# EAGLE design Yaris speed door lock-ext power and relays (EAGLE 9.2.2)
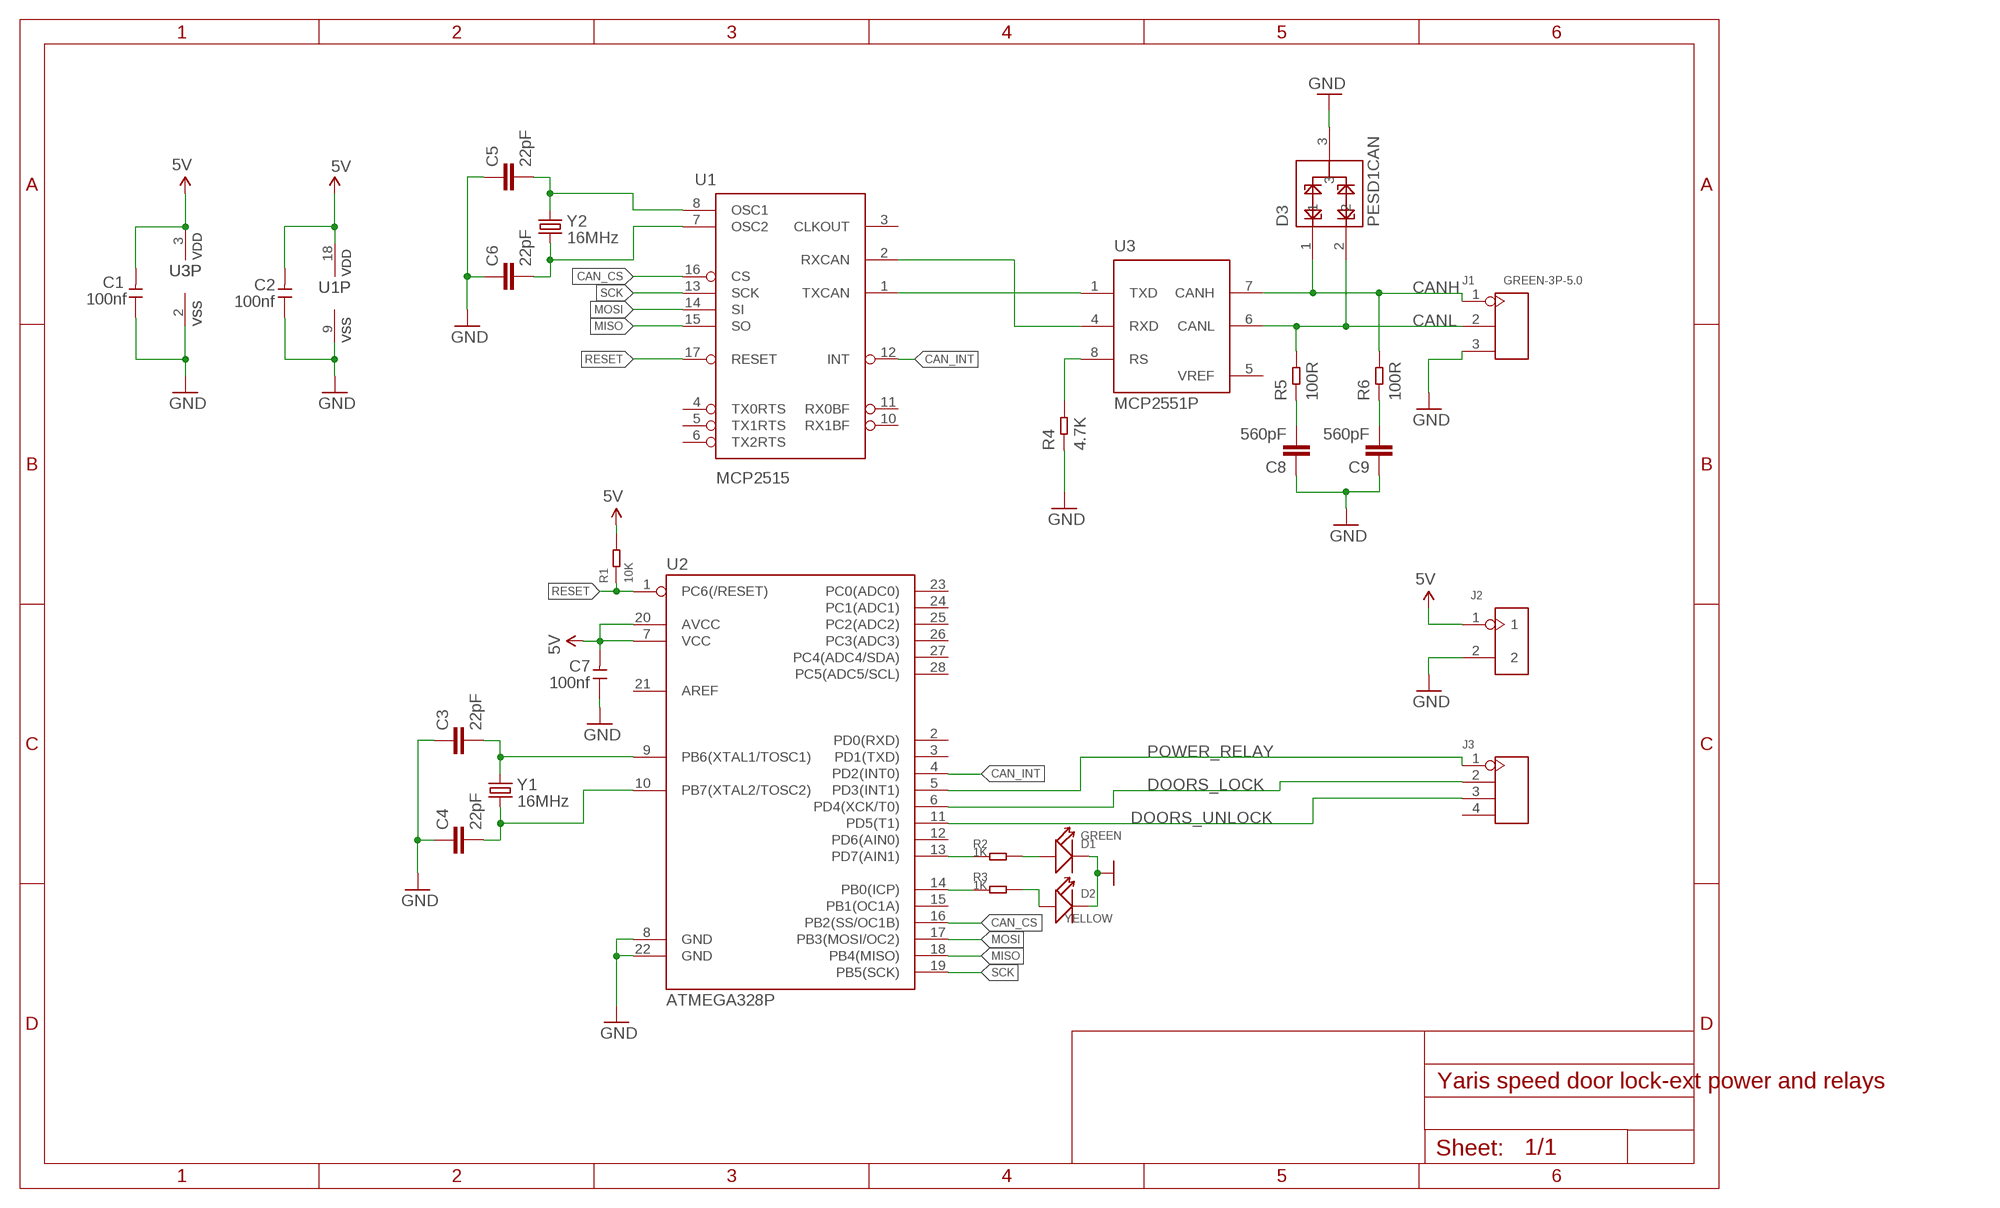
[diagram p0: schematic, sheet 1]

## Parts
C1  100nf  DIP-CERAMIC-DISC-100NF-50V-Y5V(D5.0MM)  [CERAMIC-2.54]
C2  100nf  DIP-CERAMIC-DISC-100NF-50V-Y5V(D5.0MM)  [CERAMIC-2.54]
C3  22pF  22PF-PTH-2.54MM-200V-5%  [CAP-PTH-2.54]
C4  22pF  22PF-PTH-2.54MM-200V-5%  [CAP-PTH-2.54]
C5  22pF  22PF-PTH-2.54MM-200V-5%  [CAP-PTH-2.54]
C6  22pF  22PF-PTH-2.54MM-200V-5%  [CAP-PTH-2.54]
C7  100nf  DIP-CERAMIC-DISC-100NF-50V-Y5V(D5.0MM)  [CERAMIC-2.54]
C8  560pF  560PF-50V-5%(0603)  [0603-CAP]
C9  560pF  560PF-50V-5%(0603)  [0603-CAP]
D1  GREEN  DIP-LED-GREEN-GREEN(2P-D3MM)  [LED2-2.54-D3.0MM]
D2  YELLOW  DIP-LED-GREEN-GREEN(2P-D3MM)  [LED2-2.54-D3.0MM]
D3  PESD1CAN  [SOT23-3]
J1  GREEN-3P-5.0  SCREW-TERMINAL-GREEN(3P-5.0)  [H3-5.0-15.5X8.0MM]
J2  DIP-BLACK-JUMPER  [H2-2.54]
J3  DIP-BLACK-FEMALE-HEADER-VERT(4P-2.54)  [H4-2.54]
R1  10K  DIP-RES-10K-5%-1/4W(PR-D2.3XL6.5MM)  [PR-D2.3XL6.5MM]
R2  1K  DIP-RES-1K-5%-1/4W(PR-D2.3XL6.5MM)  [PR-D2.3XL6.5MM]
R3  1K  DIP-RES-1K-5%-1/4W(PR-D2.3XL6.5MM)  [PR-D2.3XL6.5MM]
R4  4.7K  DIP-RES-4.7K-5%-1/4W(PR-D2.3XL6.5MM)  [PR-D2.3XL6.5MM]
R5  100R  DIP-RES-100R-5%-1/4W(PR-D2.3XL6.5MM)  [PR-D2.3XL6.5MM]
R6  100R  DIP-RES-100R-5%-1/4W(PR-D2.3XL6.5MM)  [PR-D2.3XL6.5MM]
U1  MCP2515  MCP2510SO  [SO-18W]
U2  ATMEGA328P  ATMEGA328P_PDIP  [DIP28]
U3  MCP2551P  [DIL8]
Y1  16MHz  CRYSTALHC49US  [HC49US]
Y2  16MHz  CRYSTALHC49US  [HC49US]

## Nets
5V: C1.2 C2.2 C7.2 J2.1 R1.2 U1.18(VDD) U2.7(VCC) U2.20(AVCC) U3.3(VDD)
CAN_CS: U1.16(CS) U2.16(PB2(SS/OC1B))
CAN_INT: U1.12(INT) U2.4(PD2(INT0))
CAN_RXD: U1.2(RXCAN) U3.4(RXD)
CAN_TXD: U1.1(TXCAN) U3.1(TXD)
CANH: D3.1 J1.1 R6.2 U3.7(CANH)
CANL: D3.2 J1.2 R5.2 U3.6(CANL)
DOORS_LOCK: J3.2 U2.6(PD4(XCK/T0))
DOORS_UNLOCK: J3.3 U2.11(PD5(T1))
GND: C1.1 C2.1 C3.1 C4.1 C5.1 C6.1 C7.1 C8.1 C9.1 D1.K(-) D2.K(-) D3.3 J1.3 J2.2 R4.1 U1.9(VSS) U2.8(GND) U2.22(GND) U3.2(VSS)
MISO: U1.15(SO) U2.18(PB4(MISO))
MOSI: U1.14(SI) U2.17(PB3(MOSI/OC2))
N$1: C3.2 U2.9(PB6(XTAL1/TOSC1)) Y1.2
N$2: C4.2 U2.10(PB7(XTAL2/TOSC2)) Y1.1
N$9: C8.2 R5.1
N$10: C9.2 R6.1
N$13: R2.1 U2.13(PD7(AIN1))
N$14: R4.2 U3.8(RS)
N$15: R3.1 U2.14(PB0(ICP))
N$16: D1.A(+) R2.2
N$17: C5.2 U1.8(OSC1) Y2.2
N$18: C6.2 U1.7(OSC2) Y2.1
N$19: D2.A(+) R3.2
POWER_RELAY: J3.1 U2.5(PD3(INT1))
RESET: R1.1 U1.17(RESET) U2.1(PC6(/RESET))
SCK: U1.13(SCK) U2.19(PB5(SCK))
Unconnected: J3.4 U1.3(CLKOUT) U1.4(TX0RTS) U1.5(TX1RTS) U1.6(TX2RTS) U1.10(RX1BF) U1.11(RX0BF) U2.2(PD0(RXD)) U2.3(PD1(TXD)) U2.12(PD6(AIN0)) U2.15(PB1(OC1A)) U2.21(AREF) U2.23(PC0(ADC0)) U2.24(PC1(ADC1)) U2.25(PC2(ADC2)) U2.26(PC3(ADC3)) U2.27(PC4(ADC4/SDA)) U2.28(PC5(ADC5/SCL))

## Power pins joined to a net without a drawn wire
VREF: U3.5(VREF)

## Library data of the parts
C1 C2 C7 = OPL_Capacitor:DIP-CERAMIC-DISC-100NF-50V-Y5V(D5.0MM): 302010208; MPN: CC1-F5SL2A101KSPW
C3-C6 = SparkFun-Capacitors:22PF: 22pF ceramic capacitors A capacitor is a passive two-terminal electrical component used to store electrical energy temporarily in an electric field.; PROD_ID: CAP-09128
C8 C9 = SparkFun-Capacitors:560PF-50V-5%(0603): CAP-08749; PROD_ID: CAP-08749
D1 D2 = OPL_Optoelectronics:DIP-LED-GREEN-GREEN(2P-D3MM): 304090040; MPN: CX-G302DC; VALUE: CX-G302DC
D3 = SparkFun-DiscreteSemi:PESD1CAN: PESD1CAN is used to protect two automotive CAN bus lines from ESD.; PROD_ID: DIO-12501
J1 = OPL_Connector:SCREW-TERMINAL-GREEN(3P-5.0): 320110029
J2 = OPL_Connector:DIP-BLACK-JUMPER: 320190003
J3 = OPL_Connector:DIP-BLACK-FEMALE-HEADER-VERT(4P-2.54): 320030017; MPN: F185-1104A1BSYA1; VALUE: 4p-2.54
R1 = OPL_Resistor:DIP-RES-10K-5%-1/4W(PR-D2.3XL6.5MM): 301020001; MPN: FHCFR-1/4W-103J
R2 R3 = OPL_Resistor:DIP-RES-1K-5%-1/4W(PR-D2.3XL6.5MM): 301020000; MPN: FHCFR-1/4W-102J
R4 = OPL_Resistor:DIP-RES-4.7K-5%-1/4W(PR-D2.3XL6.5MM): 301020012; MPN: FHCFR-1/4W-472J
R5 R6 = OPL_Resistor:DIP-RES-100R-5%-1/4W(PR-D2.3XL6.5MM): 301020017; MPN: FHCFR-1/4W-101J
U1 = SparkFun-DigitalIC:MCP2510: CAN controller with SPI interface to any MCU. Original design by Microchip.; PROD_ID: IC-09906
U2 = SparkFun-IC-Microcontroller:ATMEGA328P_PDIP: Atmel 328P Through hole ATMEGA328P uC used in the Arduino 32kb flash, 1k EEPROM, 2k SRAM Datasheet <http://www.sparkfun.com/datasheets/Components/SMD/ATMega328.pdf> SparkFun Products Storefront component: AVR 28 Pin 20MHz 32K 6A/D - ATMega328P <https://www.sparkfun.com/products/9061> (COM-09061) SparkFun Simon Says - Through-Hole Soldering Kit <https://www.sparkfun.com/products/10547> (KIT-10547) SparkFun Learn to Solder - Simon Says <https://www.sparkfun.com/products/13708> (KIT-13708) SparkFun BigTime Watch Kit <https://www.sparkfun.com/products/11734> (KIT-11734) SparkFun ClockIt <https://www.sparkfun.com/products/10930> (KIT-10930) SparkFun Serial Enabled LCD Kit <https://www.sparkfun.com/products/10097> (LCD-10097) SparkFun Simon Tilts - Through Hole Soldering Kit <https://www.sparkfun.com/products/12634> (KIT-12634) SparkFun Frequency Counter Kit <https://www.sparkfun.com/products/10140> (KIT-10140) FabFM Radio Kit <https://www.sparkfun.com/products/11043> (KIT-11043) SparkFun Binary Blaster Kit <https://www.sparkfun.com/products/12037> (KIT-12037) SparkFun Metro-Gnome <https://www.sparkfun.com/products/9236> (KIT-09236) ATmega328 with Arduino Optiboot (Uno) <https://www.sparkfun.com/products/10524> (DEV-10524); PROD_ID: IC-09136; VALUE: 328P
U3 = microchip_can:MCP2551: High Speed CAN tranceiver
Y1 Y2 = SparkFun-FreqCtrl:CRYSTAL: Various standard crystals. Proven footprints.

## Net classes
0 default: width 0.5 mm, drill 0.8 mm, clearance 0.5 mm

## Board
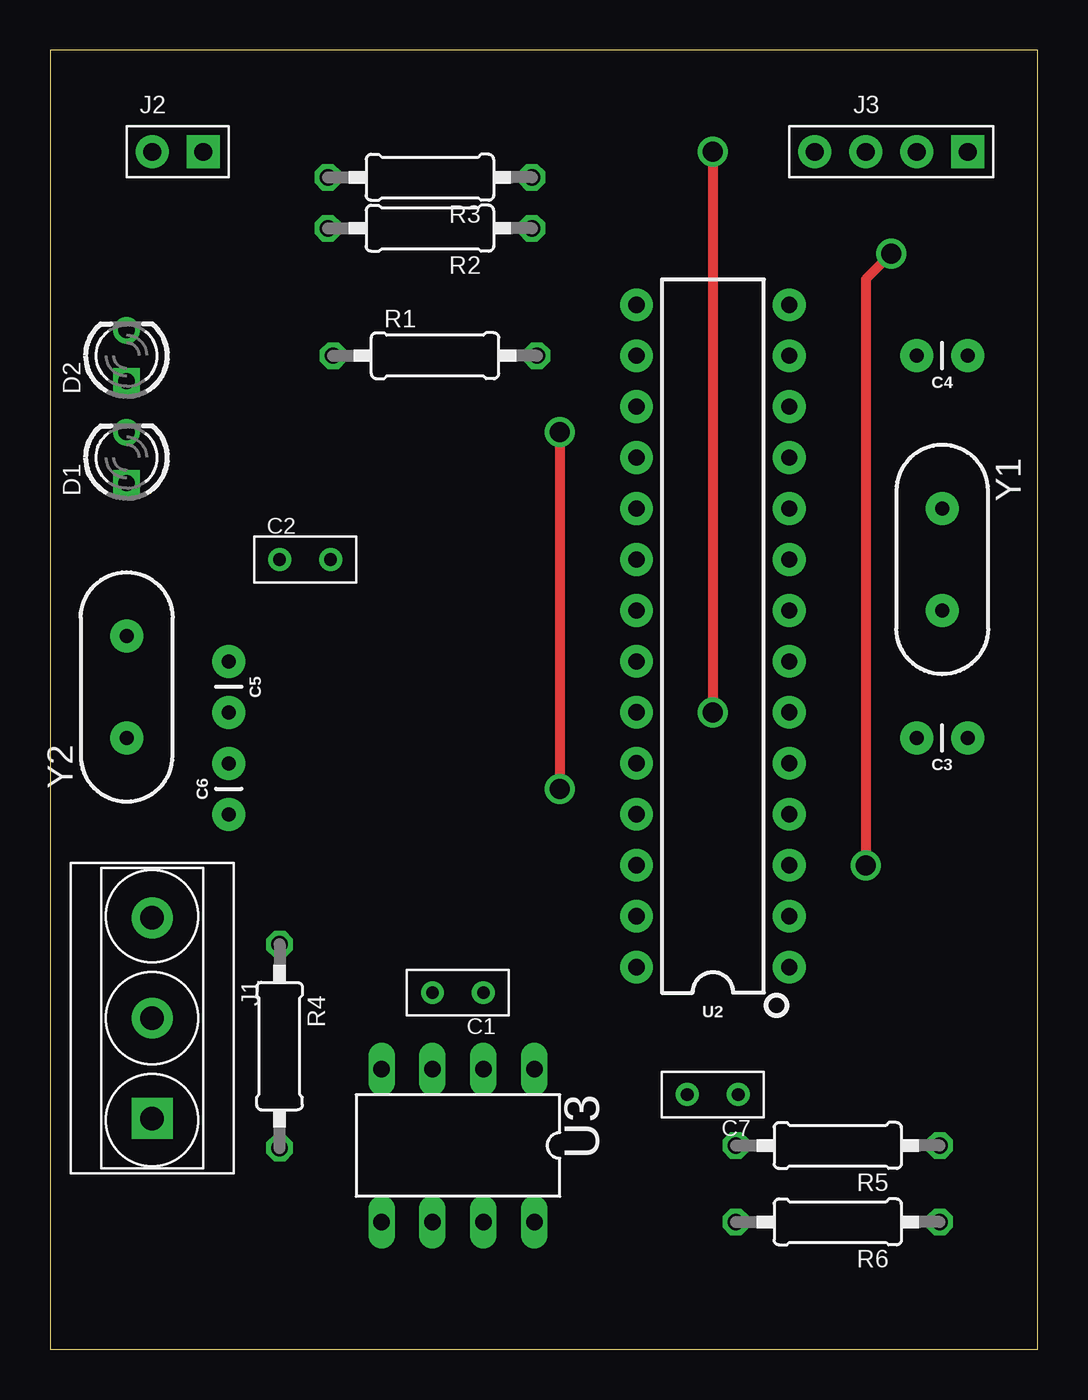
[diagram p1: board, top side]
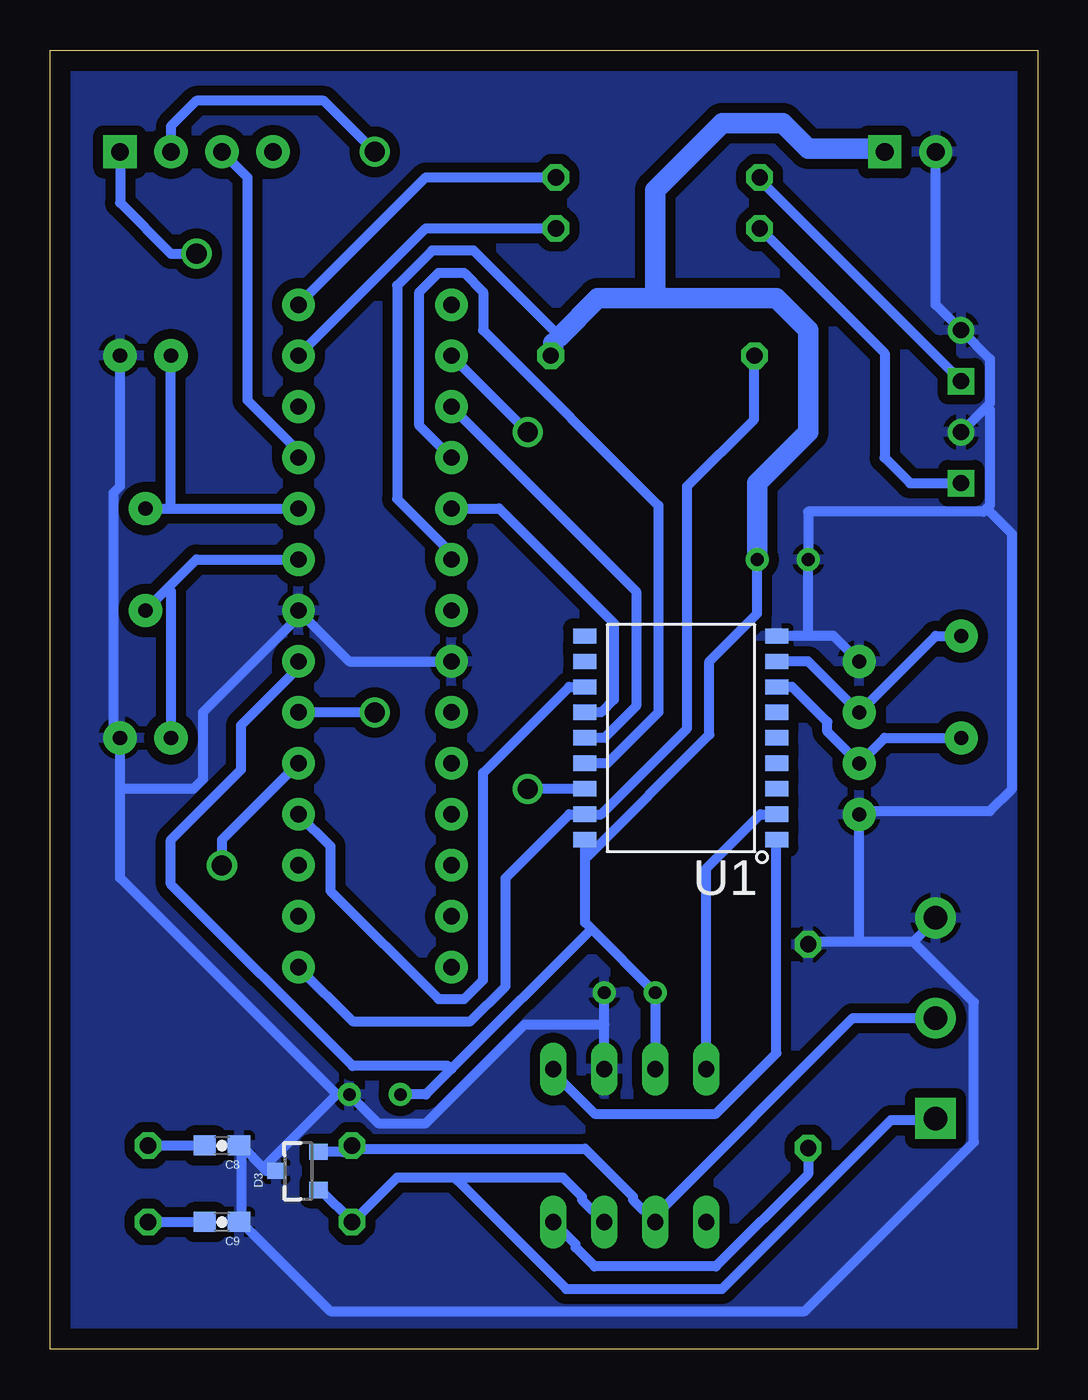
[diagram p2: board, bottom side, seen from below]

Size 49.2 x 64.76 mm. Coordinates in mm from the lower left corner, seen from the top.
Outline: 0,0 49.2,0 49.2,64.76 0,64.76 0,0
Copper layers (1*16): Top 0.035mm / dielectric 1.5mm / Bottom 0.035mm
Design rules "Yaris speed door lock-ext power and relays": minimum track width 6mil, minimum drill 0.35mm, track to track 0.205mm, track to pad 0.205mm, pad to pad 0.205mm, via to via 0.205mm, smd to smd 6mil, copper to edge 40mil, drill to drill 6mil, minimum pad ring 10mil, minimum via ring 8mil, stop-mask expansion 4mil, vias tented up to drill 0mil, thermal gap 10mil

### Footprints (pad centres in the part's own frame; a part is rotated, then mirrored left to right if it is on the bottom)
CERAMIC-2.54 = drill 0.635 pad 1.143: 1 -1.27,0; 2 1.27,0
CAP-PTH-2.54 = drill 0.7 pad 1.651: 1 -1.27,0; 2 1.27,0
0603-CAP = smd 1.1 x 1: 1 -0.85,0; 2 0.85,0
LED2-2.54-D3.0MM = drill 0.813 square: A -1.27,0 | drill 0.813: K 1.27,0
SOT23-3 = smd 0.8 x 0.9: 1 -0.95,-1; 2 0.95,-1; 3 0,1.1
H3-5.0-15.5X8.0MM = drill 1.168 pad 2.032 square: 1 0,5 | drill 1.168 pad 2.032: 2 0,0; 3 0,-5
H2-2.54 = drill 0.889 pad 1.651 square: 1 0,1.27 | drill 0.889 pad 1.651: 2 0,-1.27
H4-2.54 = drill 0.889 pad 1.651 square: 1 0,3.81 | drill 0.889 pad 1.651: 2 0,1.27; 3 0,-1.27; 4 0,-3.81
PR-D2.3XL6.5MM = drill 0.813 octagon: 1 -4.953,0; 2 5.207,0
SO-18W = smd 0.762 x 1.143: 1 -5.08,-4.788; 2 -3.81,-4.788; 3 -2.54,-4.788; 4 -1.27,-4.788; 5 0,-4.788; 6 1.27,-4.788; 7 2.54,-4.788; 8 3.81,-4.788; 9 5.08,-4.788; 10 5.08,4.788; 11 3.81,4.788; 12 2.54,4.788; 13 1.27,4.788; 14 0,4.788; 15 -1.27,4.788; 16 -2.54,4.788; 17 -3.81,4.788; 18 -5.08,4.788
DIP28 = drill 0.813 pad 1.626: 1 -16.51,-3.81; 2 -13.97,-3.81; 3 -11.43,-3.81; 4 -8.89,-3.81; 5 -6.35,-3.81; 6 -3.81,-3.81; 7 -1.27,-3.81; 8 1.27,-3.81; 9 3.81,-3.81; 10 6.35,-3.81; 11 8.89,-3.81; 12 11.43,-3.81; 13 13.97,-3.81; 14 16.51,-3.81; 15 16.51,3.81; 16 13.97,3.81; 17 11.43,3.81; 18 8.89,3.81; 19 6.35,3.81; 20 3.81,3.81; 21 1.27,3.81; 22 -1.27,3.81; 23 -3.81,3.81; 24 -6.35,3.81; 25 -8.89,3.81; 26 -11.43,3.81; 27 -13.97,3.81; 28 -16.51,3.81
DIL8 = drill 0.813 long: 1 -3.81,-3.81; 2 -1.27,-3.81; 3 1.27,-3.81; 4 3.81,-3.81; 5 3.81,3.81; 6 1.27,3.81; 7 -1.27,3.81; 8 -3.81,3.81
HC49US = drill 0.7 pad 1.651: 1 -2.54,0; 2 2.54,0

### Placement (x,y rotation side)
C1  20.32,17.78 180 top
C2  12.7,39.37 0 top
C3  44.45,30.48 180 top
C4  44.45,49.53 180 top
C5  8.89,33.02 270 top
C6  8.89,27.94 90 top
C7  33.02,12.7 180 top
C8  40.64,10.16 180 bottom
C9  40.64,6.35 180 bottom
D1  3.81,44.45 90 top
D2  3.81,49.53 90 top
D3  36.83,8.89 90 bottom
J1  5.08,16.51 180 top
J2  6.35,59.69 270 top
J3  41.91,59.69 270 top
R1  19.05,49.53 0 top
R2  19.05,55.88 180 top
R3  19.05,58.42 180 top
R4  11.43,15.24 270 top
R5  39.37,10.16 180 top
R6  39.37,6.35 180 top
U1  17.78,30.48 90 bottom
U2  33.02,35.56 90 top
U3  20.32,10.16 180 top
Y1  44.45,39.37 270 top
Y2  3.81,33.02 90 top

### Tracks (layer width: path | path; a pad name or v marks a point on that pad's centre or on a via)
5V
  Bottom 0.5: 24.13,50.16 23.81,50.48 28.1,54.77 30.16,54.77 31.91,53.02 31.91,42.39 29.21,39.69 U2.20 | J2.1 7.78,59.85 | 24.13,49.53 R1.2 | 22.54,24.61 22.54,21.27 22.22,20.95 | 22.54,24.61 22.54,25.4 U1.18 | 22.22,20.95 C1.2 U3.3 | C2.2 13.97,36.67 16.35,34.29 16.35,30.64 22.38,24.61 22.54,24.61 | C7.2 30.48,12.7 29.21,13.97 | 22.22,20.95 29.21,13.97 | U2.7 36.83,33.97 39.69,31.12 39.69,28.89 43.18,25.4 43.18,23.18 34.13,14.13 29.37,14.13 29.21,13.97
  Bottom 1.016: 24.13,50.16 24.13,49.53 | 23.81,50.48 21.91,52.39 19.05,52.39 | 7.78,59.85 11.43,59.85 12.7,61.12 15.72,61.12 19.05,57.79 19.05,52.39 | C2.2 13.97,43.18 11.43,45.72 11.43,50.8 13.02,52.39 19.05,52.39
CAN_CS  (via drill 1)
  Top 0.5: v25.4,45.72 v25.4,27.94
  Bottom 0.5: U2.16 v25.4,45.72 | U1.16 v25.4,27.94
CAN_INT
  Bottom 0.5: U1.12 23.34,33.02 27.62,28.73 27.62,18.41 28.57,17.46 29.84,17.46 35.24,22.86 35.24,25.08 U2.4
CAN_RXD
  Bottom 0.5: U1.2 13.81,26.67 16.51,23.97 U3.4
CAN_TXD
  Bottom 0.5: U3.1 24.13,13.81 22.07,11.75 16.03,11.75 13.02,14.76 13.02,25.4 U1.1
CANH
  Bottom 0.5: D3.1 35.72,7.94 34.13,6.35 R6.2 33.97,6.51 31.91,8.57 28.89,8.57 | U3.7 22.7,7.46 22.7,7.62 23.65,8.57 28.89,8.57 | J1.1 5.08,11.43 7.3,11.43 15.72,3.02 23.5,3.02 28.89,8.41 28.89,8.57
CANL
  Bottom 0.5: D3.2 35.72,9.84 34.61,9.84 34.29,10.16 R5.2 33.97,10 22.54,10 20.16,7.62 20.16,7.46 U3.6 19.05,6.67 9.21,16.51 J1.2
DOORS_LOCK  (via drill 1)
  Top 0.5: v33.02,59.69 v33.02,31.75
  Bottom 0.5: v33.02,59.69 35.56,62.23 41.91,62.23 43.18,60.96 J3.2 | v33.02,31.75 U2.6
DOORS_UNLOCK
  Bottom 0.5: U2.11 36.83,44.77 39.37,47.31 39.37,58.42 J3.3
GND
  Bottom 0.5: 6.19,20.32 8.89,20.32 | 8.89,20.32 11.43,20.32 R4.1 | 6.19,20.32 5.08,21.43 J1.3 | 8.89,20.32 C6.1 8.73,26.83 2.38,26.83 1.27,27.94 1.27,40.64 2.54,41.91 | 11.43,35.56 10.16,35.56 C5.1 | 11.43,35.56 U1.9 | 11.43,35.56 C2.1 11.43,41.75 2.7,41.75 2.54,41.91 | 2.54,46.99 2.38,47.15 2.38,49.37 D2.K 5.08,52.07 J2.2 | 2.54,46.99 D1.K | 2.54,41.91 2.38,42.07 2.38,46.83 2.54,46.99 | U2.22 34.29,34.29 U2.8 36.83,36.51 41.59,31.75 41.59,28.42 42.07,27.94 45.72,27.94 | U3.2 21.59,16.19 | 21.59,16.19 C1.1 | D3.3 38.42,8.89 38.58,9.05 | 38.58,9.05 39.69,10.16 C8.1 39.69,9.84 39.69,6.35 C9.1 39.53,6.19 35.24,1.9 11.59,1.9 3.17,10.32 3.17,17.3 6.19,20.32 | 34.93,12.7 C7.1 32.86,11.27 30.48,11.27 25.56,16.19 21.59,16.19 | 38.58,9.05 34.93,12.7 | 45.72,27.94 45.72,24.45 45.72,23.49 34.93,12.7 | 45.72,27.94 C3.1 46.04,30.8 46.04,42.7 45.72,43.02 C4.1
  pour Bottom: 0,64.77 49.53,64.77 49.53,0 0,0
MISO
  Bottom 0.5: U1.15 21.43,29.21 18.89,31.75 18.89,42.07 27.62,50.8 27.62,52.7 28.57,53.66 29.84,53.66 30.8,52.7 30.8,46.04 U2.18
MOSI
  Bottom 0.5: U1.14 21.59,30.48 20,32.07 20,37.78 U2.17
N$1
  Bottom 0.5: U2.9 41.91,39.37 43.34,37.94 | Y1.2 43.34,37.94 | C3.2 43.18,37.78 43.34,37.94
N$2
  Bottom 0.5: Y1.1 43.18,41.91 | 43.18,41.91 U2.10 | 43.18,41.91 C4.2
N$9
  Bottom 0.5: R5.1 C8.2
N$10
  Bottom 0.5: R6.1 C9.2
N$13
  Bottom 0.5: R2.1 30.48,55.88 U2.13
N$14
  Bottom 0.5: U3.8 23.02,5.24 23.02,5.08 22.07,4.13 16.03,4.13 11.43,8.73 R4.2
N$15
  Bottom 0.5: R3.1 30.48,58.42 U2.14
N$16
  Bottom 0.5: 13.81,55.88 R2.2 7.62,49.66 7.62,44.45 6.35,43.18 D1.A
N$17
  Bottom 0.5: U1.8 11.43,34.29 C5.2 5.08,35.56 Y2.2
N$18
  Bottom 0.5: U1.7 12.22,33.02 10.48,31.27 10.48,30.8 C6.2 7.62,30.48 Y2.1
N$19
  Bottom 0.5: D2.A 13.97,58.42 R3.2
POWER_RELAY  (via drill 1)
  Top 0.5: v41.91,54.61 40.64,53.34 v40.64,24.13
  Bottom 0.5: J3.1 45.72,57.15 43.18,54.61 v41.91,54.61 | U2.5 40.64,25.4 v40.64,24.13
RESET
  Bottom 0.5: U2.1 34.13,16.35 28.26,16.35 26.51,18.1 26.51,23.49 23.34,26.67 U1.17 21.75,26.67 17.46,30.96 17.46,43.02 14.13,46.36 14.13,49.53 R1.1
SCK
  Bottom 0.5: U1.13 21.75,31.75 21.11,32.38 21.11,36.2 26.83,41.91 U2.19